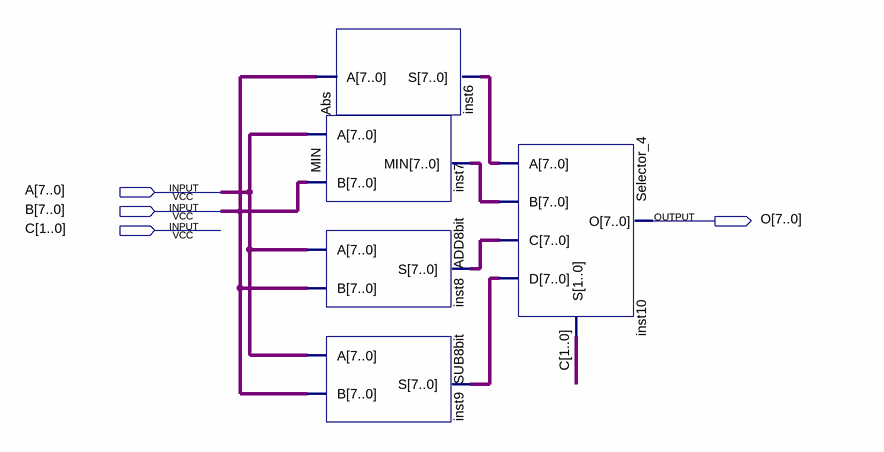
[diagram p0: schematic sheet]
// Quartus schematic ABS_MIN.bdf as structural Verilog: 5 symbols, 4 pins
module ABS_MIN (
  input  [7:0] A,
  input  [7:0] B,
  input  [1:0] C,
  output [7:0] O
);

  wire [7:0] inst6_s, inst7_min, inst8_s, inst9_s;

  Abs inst6 (.A(B), .S(inst6_s));
  MIN inst7 (.A(A), .B(B), .MIN(inst7_min));
  ADD8bit inst8 (.A(A), .B(B), .S(inst8_s));
  SUB8bit inst9 (.A(A), .B(B), .S(inst9_s));
  Selector_4 inst10 (.A(inst6_s), .B(inst7_min), .C(inst8_s), .D(inst9_s), .S(C), .O(O));
endmodule
